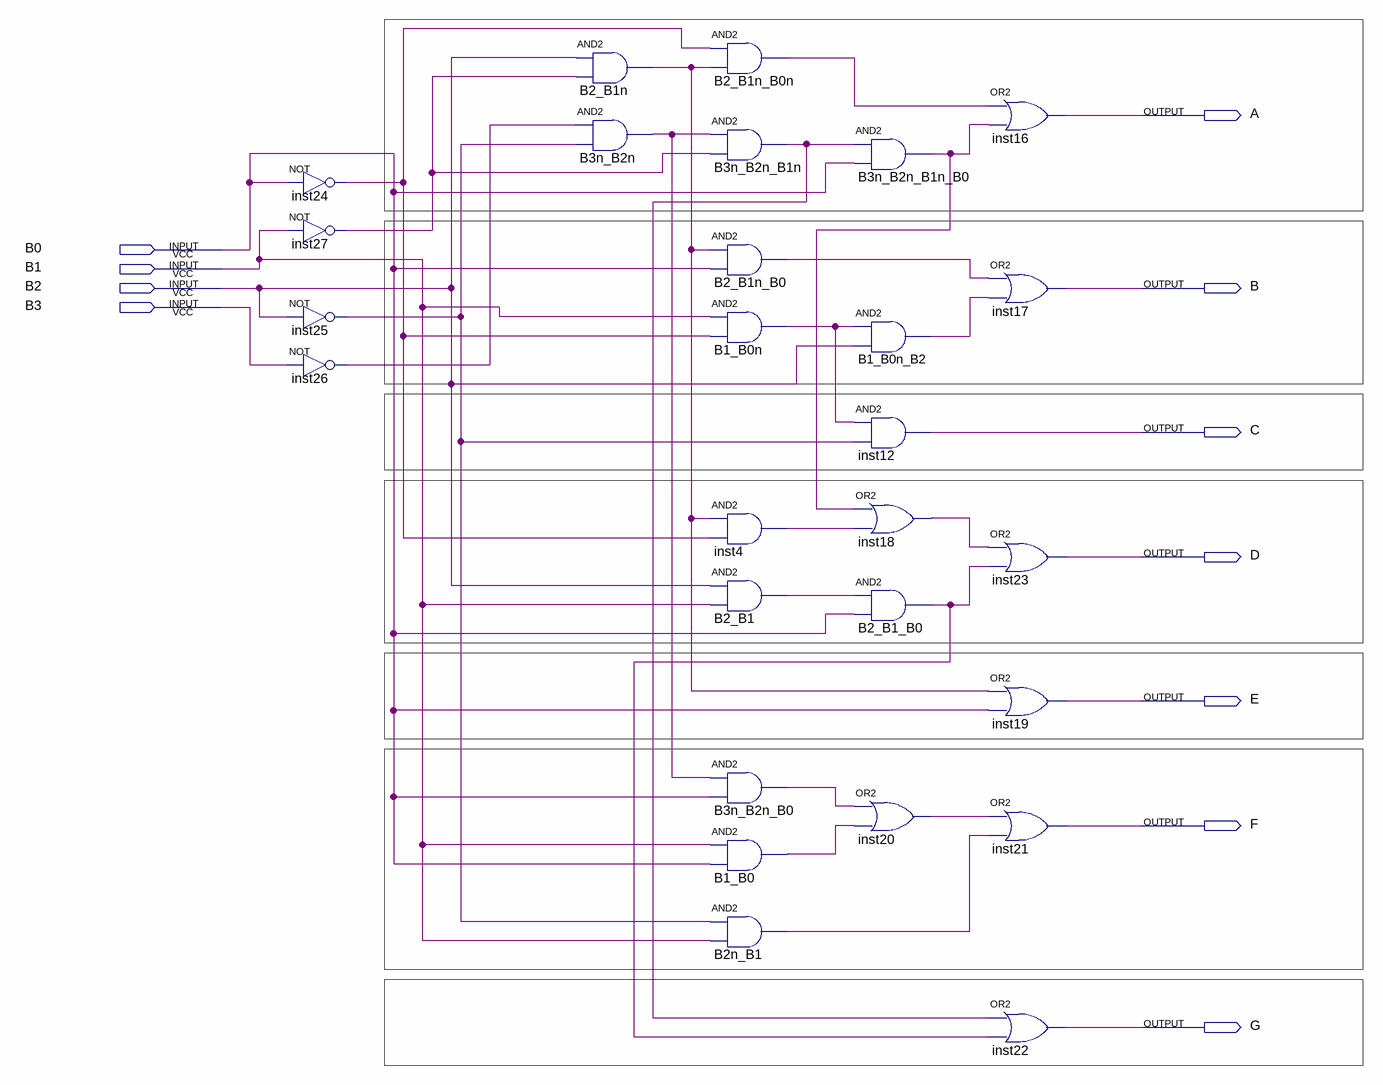
[diagram p0: schematic sheet]
// Quartus schematic seven_seg_decoder.bdf as structural Verilog: 27 symbols, 11 pins
module seven_seg_decoder (
  input  B0,
  input  B1,
  input  B2,
  input  B3,
  output A,
  output B,
  output C,
  output D,
  output E,
  output F,
  output G
);

  wire B1_B0_out, B1_B0n_B2_out, B1_B0n_out, B2_B1_B0_out, B2_B1_out, B2_B1n_B0_out, B2_B1n_B0n_out,
       B2_B1n_out, B2n_B1_out, B3n_B2n_B0_out, B3n_B2n_B1n_B0_out, B3n_B2n_B1n_out, B3n_B2n_out, inst4_out,
       inst18_out, inst20_out, inst24_out, inst25_out, inst26_out, inst27_out;

  not inst24 (inst24_out, B0);
  not inst27 (inst27_out, B1);
  not inst25 (inst25_out, B2);
  not inst26 (inst26_out, B3);
  and B2_B1n (B2_B1n_out, B2, inst27_out);
  and B3n_B2n (B3n_B2n_out, inst26_out, inst25_out);
  and B2_B1n_B0n (B2_B1n_B0n_out, inst24_out, B2_B1n_out);
  and B3n_B2n_B1n (B3n_B2n_B1n_out, B3n_B2n_out, inst27_out);
  and B2_B1n_B0 (B2_B1n_B0_out, B2_B1n_out, B0);
  and B1_B0n (B1_B0n_out, B1, inst24_out);
  and inst4 (inst4_out, B2_B1n_out, inst24_out);
  and B2_B1 (B2_B1_out, B2, B1);
  and B3n_B2n_B0 (B3n_B2n_B0_out, B3n_B2n_out, B0);
  and B1_B0 (B1_B0_out, B1, B0);
  and B2n_B1 (B2n_B1_out, inst25_out, B1);
  and B3n_B2n_B1n_B0 (B3n_B2n_B1n_B0_out, B3n_B2n_B1n_out, B0);
  and B1_B0n_B2 (B1_B0n_B2_out, B1_B0n_out, B2);
  and inst12 (C, B1_B0n_out, inst25_out);
  or inst18 (inst18_out, B3n_B2n_B1n_B0_out, inst4_out);
  and B2_B1_B0 (B2_B1_B0_out, B2_B1_out, B0);
  or inst20 (inst20_out, B3n_B2n_B0_out, B1_B0_out);
  or inst16 (A, B2_B1n_B0n_out, B3n_B2n_B1n_B0_out);
  or inst17 (B, B2_B1n_B0_out, B1_B0n_B2_out);
  or inst23 (D, inst18_out, B2_B1_B0_out);
  or inst19 (E, B2_B1n_out, B0);
  or inst21 (F, inst20_out, B2n_B1_out);
  or inst22 (G, B3n_B2n_B1n_out, B2_B1_B0_out);
endmodule
